# EAGLE schematic IronKid_ISTA (EAGLE 7.6.0)
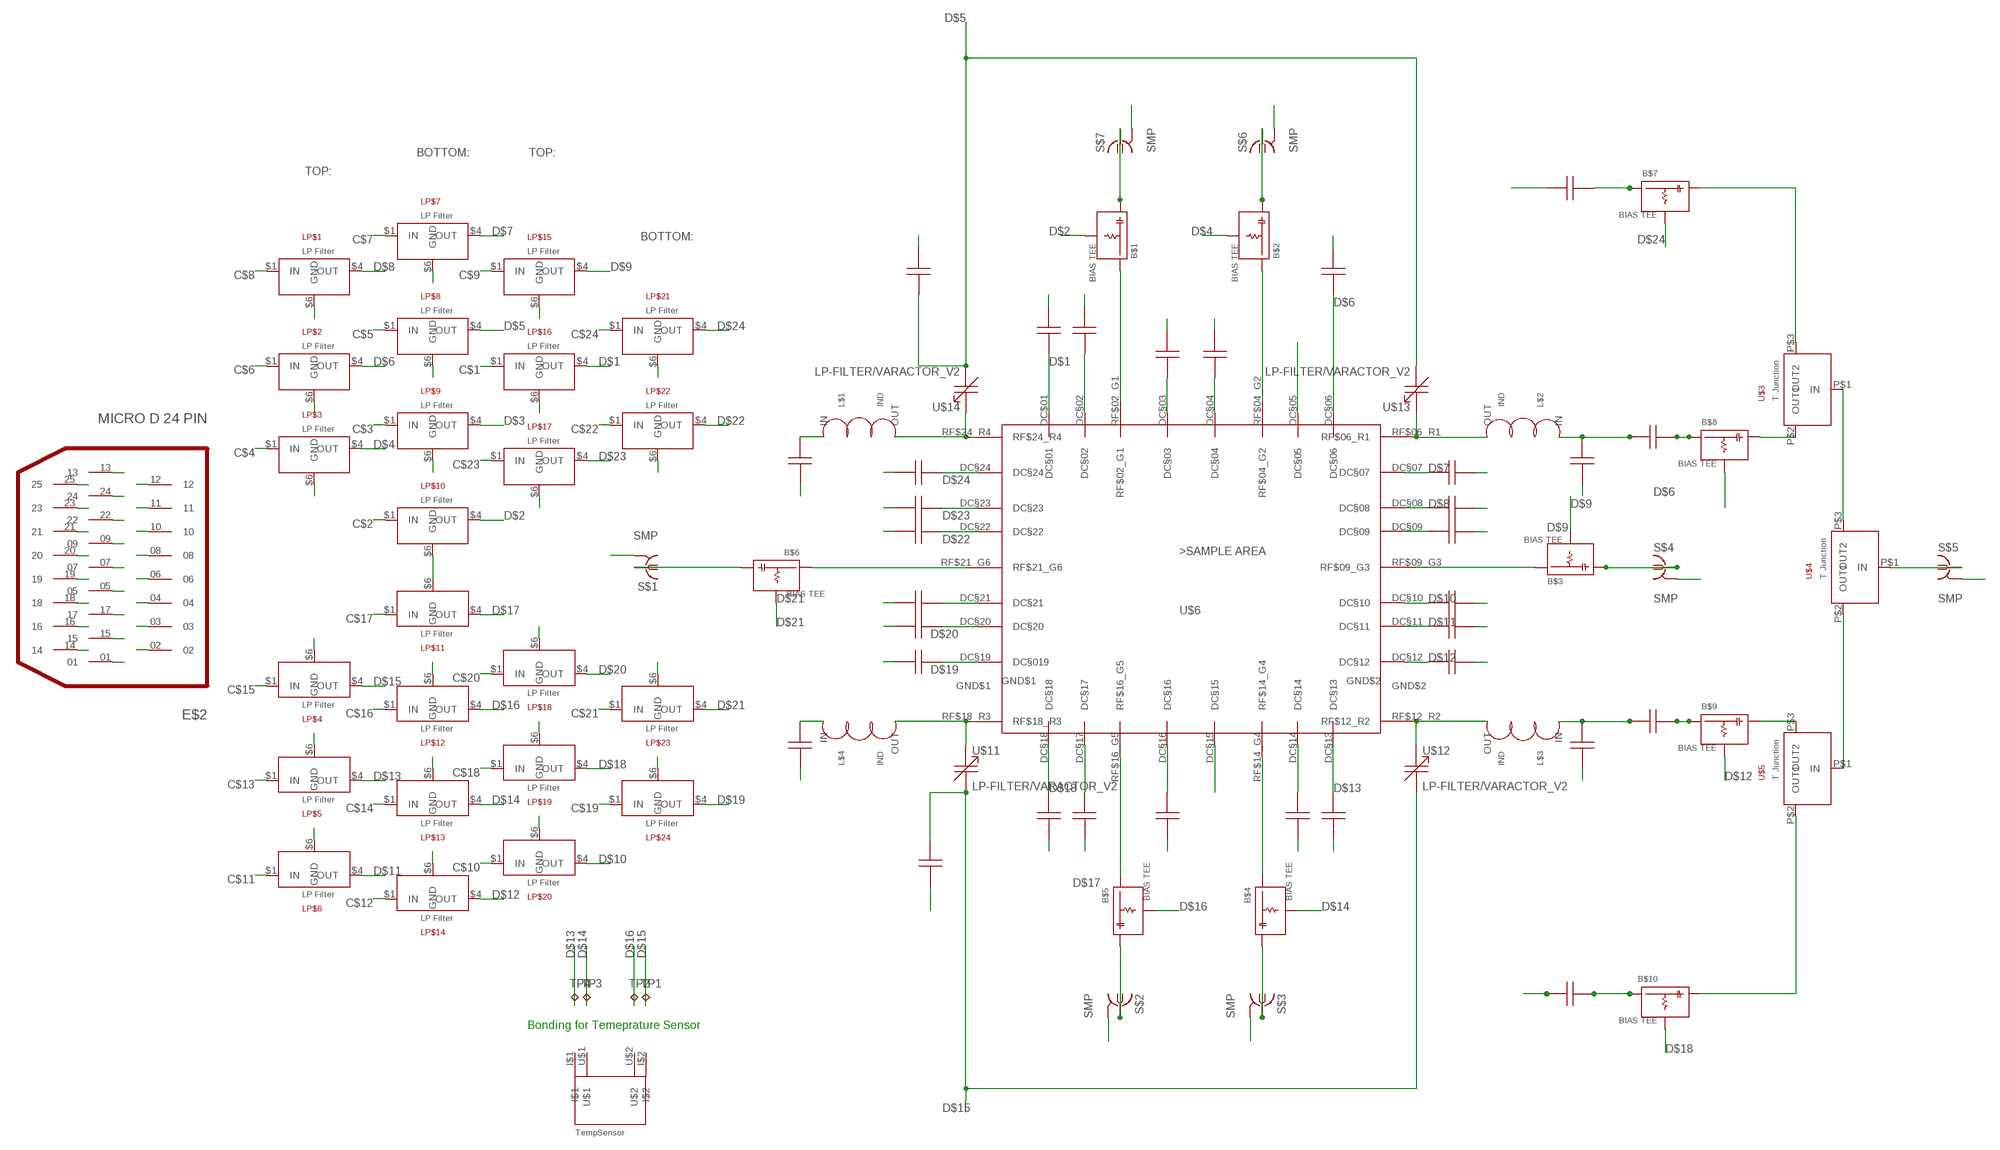
[diagram p0: schematic, sheet 1, part 1 of 2]
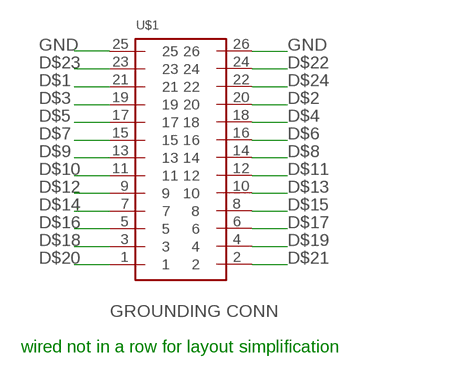
[diagram p1: schematic, sheet 1, part 2 of 2]

## Parts
B$1  BIASTEEDOWN2  [BIAS_TEE_DOWN_0603_V02]
B$2  BIASTEEUP1  [BIAS_TEE_UP_0603]
B$3  BIASTEEDOWN1  [BIAS_TEE_DOWN_0603]
B$4  BIASTEEDOWN1  [BIAS_TEE_DOWN_0603]
B$5  BIASTEEUP2  [BIAS_TEE_UP_0603_V02]
B$6  BIASTEEDOWN1  [BIAS_TEE_DOWN_0603]
B$7  BIASTEEUP1  [BIAS_TEE_UP_0603]
B$8  BIASTEEDOWN1  [BIAS_TEE_DOWN_0603]
B$9  BIASTEEUP1  [BIAS_TEE_UP_0603]
B$10  BIASTEEDOWN1  [BIAS_TEE_DOWN_0603]
E$2  25_SOCKET_M83513(13-DPINOUT2  [25_SOCKET_M83513/13-D_V2]
L$1  L_MATCH  [L_MATCH]
L$2  L_MATCH  [L_MATCH]
L$3  L_MATCH  [L_MATCH]
L$4  L_MATCH  [L_MATCH]
LP$1  LP-FILTER/1-STAGETOP  [LP-FILTER/1_STAGE/OS/0603_TOP]
LP$2  LP-FILTER/1-STAGETOP  [LP-FILTER/1_STAGE/OS/0603_TOP]
LP$3  LP-FILTER/1-STAGETOP  [LP-FILTER/1_STAGE/OS/0603_TOP]
LP$4  LP-FILTER/1-STAGETOP  [LP-FILTER/1_STAGE/OS/0603_TOP]
LP$5  LP-FILTER/1-STAGETOP  [LP-FILTER/1_STAGE/OS/0603_TOP]
LP$6  LP-FILTER/1-STAGETOP  [LP-FILTER/1_STAGE/OS/0603_TOP]
LP$7  LP-FILTER/1-STAGEBOT  [LP-FILTER/1_STAGE/OS/0603_BOTTOM]
LP$8  LP-FILTER/1-STAGEBOT  [LP-FILTER/1_STAGE/OS/0603_BOTTOM]
LP$9  LP-FILTER/1-STAGEBOT  [LP-FILTER/1_STAGE/OS/0603_BOTTOM]
LP$10  LP-FILTER/1-STAGEBOT  [LP-FILTER/1_STAGE/OS/0603_BOTTOM]
LP$11  LP-FILTER/1-STAGEBOT  [LP-FILTER/1_STAGE/OS/0603_BOTTOM]
LP$12  LP-FILTER/1-STAGEBOT  [LP-FILTER/1_STAGE/OS/0603_BOTTOM]
LP$13  LP-FILTER/1-STAGEBOT  [LP-FILTER/1_STAGE/OS/0603_BOTTOM]
LP$14  LP-FILTER/1-STAGEBOT  [LP-FILTER/1_STAGE/OS/0603_BOTTOM]
LP$15  LP-FILTER/1-STAGETOP  [LP-FILTER/1_STAGE/OS/0603_TOP]
LP$16  LP-FILTER/1-STAGETOP  [LP-FILTER/1_STAGE/OS/0603_TOP]
LP$17  LP-FILTER/1-STAGETOP  [LP-FILTER/1_STAGE/OS/0603_TOP]
LP$18  LP-FILTER/1-STAGETOP  [LP-FILTER/1_STAGE/OS/0603_TOP]
LP$19  LP-FILTER/1-STAGETOP  [LP-FILTER/1_STAGE/OS/0603_TOP]
LP$20  LP-FILTER/1-STAGETOP  [LP-FILTER/1_STAGE/OS/0603_TOP]
LP$21  LP-FILTER/1-STAGEBOT  [LP-FILTER/1_STAGE/OS/0603_BOTTOM]
LP$22  LP-FILTER/1-STAGEBOT  [LP-FILTER/1_STAGE/OS/0603_BOTTOM]
LP$23  LP-FILTER/1-STAGEBOT  [LP-FILTER/1_STAGE/OS/0603_BOTTOM]
LP$24  LP-FILTER/1-STAGEBOT  [LP-FILTER/1_STAGE/OS/0603_BOTTOM]
S$1  MC-921WIDE  [SMP_STRAIGHT_MINI_WIDE]
S$2  MC-921WIDE  [SMP_STRAIGHT_MINI_WIDE]
S$3  MC-921WIDE  [SMP_STRAIGHT_MINI_WIDE]
S$4  MC-921WIDE  [SMP_STRAIGHT_MINI_WIDE]
S$5  MC-921WIDE  [SMP_STRAIGHT_MINI_WIDE]
S$6  MC-921WIDE  [SMP_STRAIGHT_MINI_WIDE]
S$7  MC-921WIDE  [SMP_STRAIGHT_MINI_WIDE]
TP1  TPTP07SQ  [TP07SQ]
TP2  TPTP07SQ  [TP07SQ]
TP3  TPTP07SQ  [TP07SQ]
TP4  TPTP07SQ  [TP07SQ]
U$1  MEC8-113-02-L-D-RA1MBRD  [MEC8-113-02-L-D-RA1]
U$2  TEMPSENS  [RX-BR_V1]
U$3  TJUNCTION  [T_JUNCTION_0.3MM]
U$4  TJUNCTION  [T_JUNCTION_0.3MM]
U$5  TJUNCTION  [T_JUNCTION_0.3MM]
U$6  24DC+10RF_V3.0  [24DC+10RF/400MU-PADS/0.7X0.7_V3.0]
U$7  LP-FILTER/CAPACITOR/0603THIN  [LP-FILTER/CAPACITOR/0603_BOTTOM]
U$8  LP-FILTER/CAPACITOR/0603THIN  [LP-FILTER/CAPACITOR/0603_BOTTOM]
U$9  LP-FILTER/CAPACITOR/0603THIN  [LP-FILTER/CAPACITOR/0603_BOTTOM]
U$10  LP-FILTER/CAPACITOR/0603THIN  [LP-FILTER/CAPACITOR/0603_BOTTOM]
U$11  LP-FILTER/VARACTOR_V2  [LP-FILTER/VARACTOR_V2]
U$12  LP-FILTER/VARACTOR_V2  [LP-FILTER/VARACTOR_V2]
U$13  LP-FILTER/VARACTOR_V2  [LP-FILTER/VARACTOR_V2]
U$14  LP-FILTER/VARACTOR_V2  [LP-FILTER/VARACTOR_V2]
U$15  LP-FILTER/CAPACITOR/0603NORMAL  [LP-FILTER/CAPACITOR/0603_BOTTOM_V2]
U$16  LP-FILTER/CAPACITOR/0603NORMAL  [LP-FILTER/CAPACITOR/0603_BOTTOM_V2]
U$17  LP-FILTER/CAPACITOR/0603THIN  [LP-FILTER/CAPACITOR/0603_BOTTOM]
U$18  LP-FILTER/CAPACITOR/0603THIN  [LP-FILTER/CAPACITOR/0603_BOTTOM]
U$19  LP-FILTER/CAPACITOR/0603THIN  [LP-FILTER/CAPACITOR/0603_BOTTOM]
U$20  LP-FILTER/CAPACITOR/0603THIN  [LP-FILTER/CAPACITOR/0603_BOTTOM]
U$21  LP-FILTER/CAPACITOR/0603NORMAL  [LP-FILTER/CAPACITOR/0603_BOTTOM_V2]
U$22  LP-FILTER/CAPACITOR/0603NORMAL  [LP-FILTER/CAPACITOR/0603_BOTTOM_V2]
U$23  LP-FILTER/CAPACITOR/0603NORMAL  [LP-FILTER/CAPACITOR/0603_BOTTOM_V2]
U$24  LP-FILTER/CAPACITOR/0603NORMAL  [LP-FILTER/CAPACITOR/0603_BOTTOM_V2]
U$26  LP-FILTER/CAPACITOR/0603NORMAL  [LP-FILTER/CAPACITOR/0603_BOTTOM_V2]
U$27  LP-FILTER/CAPACITOR/0603NORMAL  [LP-FILTER/CAPACITOR/0603_BOTTOM_V2]
U$28  LP-FILTER/CAPACITOR/0603NORMAL  [LP-FILTER/CAPACITOR/0603_BOTTOM_V2]
U$29  LP-FILTER/CAPACITOR/0603NORMAL  [LP-FILTER/CAPACITOR/0603_BOTTOM_V2]
U$30  LP-FILTER/CAPACITOR/0603NORMAL  [LP-FILTER/CAPACITOR/0603_BOTTOM_V2]
U$31  LP-FILTER/CAPACITOR/0603NORMAL  [LP-FILTER/CAPACITOR/0603_BOTTOM_V2]
U$32  LP-FILTER/CAPACITOR/0603NORMAL  [LP-FILTER/CAPACITOR/0603_BOTTOM_V2]
U$33  LP-FILTER/CAPACITOR/0603NORMAL  [LP-FILTER/CAPACITOR/0603_BOTTOM_V2]
U$34  LP-FILTER/CAPACITOR/0603NORMAL  [LP-FILTER/CAPACITOR/0603_BOTTOM_V2]
U$36  LP-FILTER/CAPACITOR/0603NORMAL  [LP-FILTER/CAPACITOR/0603_BOTTOM_V2]
U$37  LP-FILTER/CAPACITOR/0603NORMAL  [LP-FILTER/CAPACITOR/0603_BOTTOM_V2]
U$38  LP-FILTER/CAPACITOR/0603NORMAL  [LP-FILTER/CAPACITOR/0603_BOTTOM_V2]
U$39  LP-FILTER/CAPACITOR/0603NORMAL  [LP-FILTER/CAPACITOR/0603_BOTTOM_V2]
U$40  LP-FILTER/CAPACITOR/0603NORMAL  [LP-FILTER/CAPACITOR/0603_BOTTOM_V2]
U$41  LP-FILTER/CAPACITOR/0603NORMAL  [LP-FILTER/CAPACITOR/0603_BOTTOM_V2]
U$42  LP-FILTER/CAPACITOR/0603NORMAL  [LP-FILTER/CAPACITOR/0603_BOTTOM_V2]
U$43  LP-FILTER/CAPACITOR/0603NORMAL  [LP-FILTER/CAPACITOR/0603_BOTTOM_V2]
U$44  LP-FILTER/CAPACITOR/0603NORMAL  [LP-FILTER/CAPACITOR/0603_BOTTOM_V2]

## Nets
C$1: E$2.01 LP$16.$1(IN)
C$2: E$2.02 LP$10.$1(IN)
C$3: E$2.03 LP$9.$1(IN)
C$4: E$2.04 LP$3.$1(IN)
C$5: E$2.05 LP$8.$1(IN)
C$6: E$2.06 LP$2.$1(IN)
C$7: E$2.07 LP$7.$1(IN)
C$8: E$2.08 LP$1.$1(IN)
C$9: E$2.09 LP$15.$1(IN)
C$10: E$2.10 LP$20.$1(IN)
C$11: E$2.11 LP$6.$1(IN)
C$12: E$2.12 LP$14.$1(IN)
C$13: E$2.13 LP$5.$1(IN)
C$14: E$2.14 LP$13.$1(IN)
C$15: E$2.15 LP$4.$1(IN)
C$16: E$2.16 LP$12.$1(IN)
C$17: E$2.17 LP$11.$1(IN)
C$18: E$2.18 LP$19.$1(IN)
C$19: E$2.19 LP$24.$1(IN)
C$20: E$2.20 LP$18.$1(IN)
C$21: E$2.21 LP$23.$1(IN)
C$22: E$2.22 LP$22.$1(IN)
C$23: E$2.23 LP$17.$1(IN)
C$24: E$2.24 LP$21.$1(IN)
D$1: LP$16.$4(OUT) U$1.21 U$6.DC$01(DC§01) U$21.OUT
D$2: B$1.LF LP$10.$4(OUT) U$1.20 U$6.DC§02 U$22.OUT
D$3: LP$9.$4(OUT) U$1.19 U$6.DC§03 U$23.OUT
D$4: B$2.LF LP$3.$4(OUT) U$1.18 U$6.DC§04 U$24.OUT
D$5: LP$8.$4(OUT) U$1.17 U$6.DC§05 U$13.OUT1 U$14.OUT1 U$15.OUT
D$6: B$8.LF LP$2.$4(OUT) U$1.16 U$6.DC§06 U$26.OUT
D$7: LP$7.$4(OUT) U$1.15 U$6.DC§07 U$27.OUT
D$8: LP$1.$4(OUT) U$1.14 U$6.DC§08 U$28.OUT
D$9: B$3.LF LP$15.$4(OUT) U$1.13 U$6.DC§09 U$29.OUT
D$10: LP$20.$4(OUT) U$1.11 U$6.DC§10 U$30.OUT
D$11: LP$6.$4(OUT) U$1.12 U$6.DC§11 U$31.OUT
D$12: B$9.LF LP$14.$4(OUT) U$1.9 U$6.DC§12 U$32.OUT
D$13: LP$5.$4(OUT) TP4.TP U$1.10 U$6.DC§13 U$33.OUT
D$14: B$4.LF LP$13.$4(OUT) TP3.TP U$1.7 U$6.DC§14 U$34.OUT
D$15: LP$4.$4(OUT) TP1.TP U$1.8 U$6.DC§15 U$11.OUT1 U$12.OUT1 U$16.OUT
D$16: B$5.LF LP$12.$4(OUT) TP2.TP U$1.5 U$6.DC§16 U$36.OUT
D$17: LP$11.$4(OUT) U$1.6 U$6.DC§17 U$37.OUT
D$18: B$10.LF LP$19.$4(OUT) U$1.3 U$6.DC§18 U$38.OUT
D$19: LP$24.$4(OUT) U$1.4 U$6.DC§19(DC§019) U$39.OUT
D$20: LP$18.$4(OUT) U$1.1 U$6.DC§20 U$40.OUT
D$21: B$6.LF LP$23.$4(OUT) U$1.2 U$6.DC§21 U$41.OUT
D$22: LP$22.$4(OUT) U$1.24 U$6.DC§22 U$42.OUT
D$23: LP$17.$4(OUT) U$1.23 U$6.DC§23 U$43.OUT
D$24: B$7.LF LP$21.$4(OUT) U$1.22 U$6.DC§24 U$44.OUT
GND: E$2.25 LP$1.$6(GND) LP$2.$6(GND) LP$3.$6(GND) LP$4.$6(GND) LP$5.$6(GND) LP$6.$6(GND) LP$7.$6(GND) LP$8.$6(GND) LP$9.$6(GND) LP$10.$6(GND) LP$11.$6(GND) LP$12.$6(GND) LP$13.$6(GND) LP$14.$6(GND) LP$15.$6(GND) LP$16.$6(GND) LP$17.$6(GND) LP$18.$6(GND) LP$19.$6(GND) LP$20.$6(GND) LP$21.$6(GND) LP$22.$6(GND) LP$23.$6(GND) LP$24.$6(GND) S$1.2@1(GND) S$1.2@2(GND) S$2.2@1(GND) S$2.2@2(GND) S$3.2@1(GND) S$3.2@2(GND) S$4.2@1(GND) S$4.2@2(GND) S$5.2@1(GND) S$5.2@2(GND) S$6.2@1(GND) S$6.2@2(GND) S$7.2@1(GND) S$7.2@2(GND) U$1.25 U$1.26 U$7.OUT U$8.OUT U$9.OUT U$10.OUT U$15.IN U$16.IN U$21.IN U$22.IN U$23.IN U$24.IN U$26.IN U$27.IN U$28.IN U$29.IN U$30.IN U$31.IN U$32.IN U$33.IN U$34.IN U$36.IN U$37.IN U$38.IN U$39.IN U$40.IN U$41.IN U$42.IN U$43.IN U$44.IN
N$1 [RF2]: B$6.HF S$1.1
N$2: L$3.OUT U$6.RF$12_R2 U$12.OUT
N$3 [RF2]: B$6.OUT U$6.RF$21_G6
N$4 [RF2]: B$5.OUT U$6.RF$16_G5
N$5 [RF2]: B$1.HF S$7.1
N$6 [RF2]: B$2.HF S$6.1
N$7 [RF2]: B$4.OUT U$6.RF$14_G4
N$8 [RF2]: B$3.OUT U$6.RF$09_G3
N$9 [RF]: L$4.OUT U$6.RF$18_R3 U$11.OUT
N$10 [RF]: L$1.OUT U$6.RF$24_R4 U$14.OUT
N$11 [RF]: L$2.OUT U$6.RF$06_R1 U$13.OUT
N$12 [RF2]: B$2.OUT U$6.RF$04_G2
N$13 [RF]: L$3.IN U$9.IN U$20.IN
N$14 [RF]: L$2.IN U$10.IN U$19.IN
N$15 [RF]: B$9.HF U$5.P$3(OUT2)
N$16 [RF2]: B$5.HF S$2.1
N$17 [RF2]: B$4.HF S$3.1
N$18 [RF2]: B$3.HF S$4.1
N$19 [RF]: B$7.HF U$3.P$3(OUT2)
N$20 [RF2]: B$1.OUT U$6.RF$02_G1
N$21 [RF]: S$5.1 U$4.P$1(IN)
N$22 [RF]: B$10.HF U$5.P$2(OUT1)
N$23 [RF]: B$8.HF U$3.P$2(OUT1)
N$24 [RF]: B$8.OUT U$19.OUT
N$25 [RF]: U$3.P$1(IN) U$4.P$3(OUT2)
N$26 [RF]: U$4.P$2(OUT1) U$5.P$1(IN)
N$27 [RF]: B$9.OUT U$20.OUT
RF$3 [RF]: L$4.IN U$8.IN U$18.IN
RF$4 [RF]: L$1.IN U$7.IN U$17.IN
RF$31 [RF]: B$10.OUT U$18.OUT
RF$41 [RF]: B$7.OUT U$17.OUT
Unconnected: U$2.I$1 U$2.I$2 U$2.U$1 U$2.U$2 U$6.GND$1 U$6.GND$2

## Notes on the sheet
- BOTTOM: | TOP:
- TOP:
- BOTTOM:
- wired not in a row for layout simplification
- Bonding for Temeprature Sensor

## Library data of the parts
B$1-B$10 = Bias tee:BIASTEE
E$2 = Glenair:25_SOCKET_M83513(13-D
L$1-L$4 = MatchCircuit:L_MATCH
LP$1-LP$24 = LPFilter:LP-FILTER/1-STAGE
S$1-S$7 = RF Connectors:MC-921: COAX. MICROWAVE CONNECTOR O/D diam 2.1 Source: www.tycoelectronics.com .. Electronics .. ENG_CD_1775146_A2.pdf
TP1-TP4 = testpad:TP: Test pad
U$1 = MEC8-130-02-X-D-RA1:MEC8-113-02-L-D-RA1
U$2 = TempSensors:TEMPSENS
U$3-U$5 = RF layout parts:TJUNCTION
U$6 = SampleArea:24DC+10RF_V3.0
U$7-U$10 U$15-U$24 U$26-U$34 U$36-U$44 = LPFilter:LP-FILTER/CAPACITOR/0603
U$11-U$14 = LPFilter:LP-FILTER/VARACTOR_V2

## Net classes
0 GND: clearance 0.15 mm
1 RF: width 0.8 mm, clearance 0.5 mm
2 RF2: width 0.8 mm, clearance 0.2 mm